# Altium schematic sheet ST25DV64K-JFR6D3.SchDoc
size A4; SheetNumber: 8; SheetTotal: 11
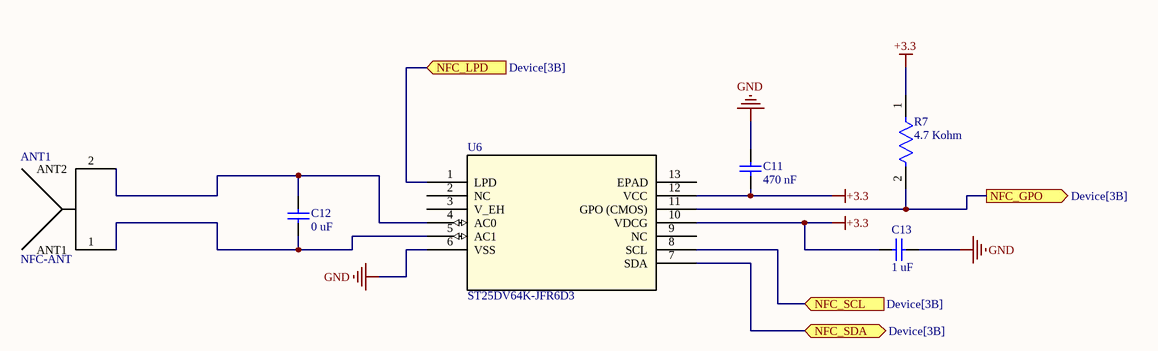
[diagram p0: ST25DV64K-JFR6D3.SchDoc]

## Parts
ANT1  NFC-ANT  [NFC-ANT]
C11  470 nF  [CAPC1005X55X25NL05T10]
C12  0 uF  [CAPC1005X55X25NL05T10]
C13  1 uF  [CAPC1005X55X25NL05T10]
R7  4.7 Kohm  [FP-RC1005-IPC_C]
U6  ST25DV64K-JFR6D3  [ST25DV64K-JFR6D3]

## Ports
NFC_GPO (out, see Device[3B]), NFC_LPD (in, see Device[3B]), NFC_SCL (in, see Device[3B]), NFC_SDA (bidir, see Device[3B])

## Nets
+3.3: C11.2 C13.1 R7.1 U6.10(VDCG) U6.12(VCC)
GND: C11.1 C13.2 U6.6(VSS)
NFC_GPO: R7.2 U6.11(GPO_(CMOS)) ; port NFC_GPO
NFC_LPD: U6.1(LPD) ; port NFC_LPD
NFC_SCL: U6.8(SCL) ; port NFC_SCL
NFC_SDA: U6.7(SDA) ; port NFC_SDA
NetANT1_1: ANT1.1(ANT1) C12.2 U6.5(AC1)
NetANT1_2: ANT1.2(ANT2) C12.1 U6.4(AC0)

Not connected (* = marked no-connect by the designer): U6 2(NC) 3(V_EH) 9(NC) 13(EPAD)

## Library data of the parts
C11-C13 = CMP-2008-04515-1: Manufacturer: Murata; Part Number: GRM155F50J684ZE01D
R7 = CMP-13261-000953-1: Res Thick Film 0402 1.87kΩ 1% 0.063W ±100ppm/°C Molded SMD T/R; Power Rating: 63mW; Voltage Rating (DC): 50V; Resistance: 1.87kR; Tolerance: 1%; Height: 0.016inch; Length: 1mm; Case Code (Metric): 1005; Width: 0.02inch; Max Power Dissipation: 63mW; Radiation Hardening: No; Features: Moisture Resistant; Temperature Coefficient: 100ppm/°C; Min Operating Temperature: -55°C; Number of Terminations: 2; Max Operating Temperature: 155°C; Case Code (Imperial): 0402; Composition: Thick Film; Depth: 0.5mm; Lead Free: Lead Free; Package Quantity: 1; Case/Package: 0402; Packaging: Tape and Reel; Contact Plating: Tin; Military Standard: Not